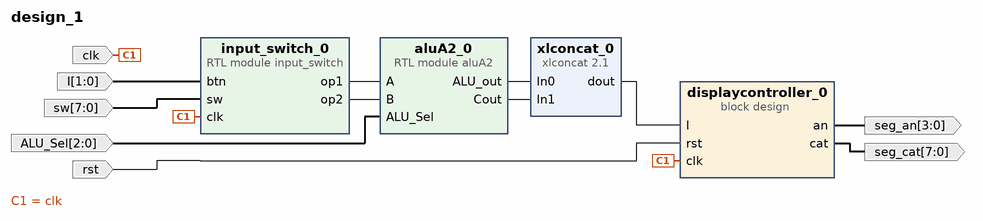
[diagram p0: block diagram of the top level]
# Vivado block design design_1, xc7z007sclg400-1, Vivado 2024.1.1
create_bd_design design_1

create_bd_port -dir I clk
create_bd_port -dir I -from 7 -to 0 sw
create_bd_port -dir I -from 1 -to 0 I
create_bd_port -dir I -from 2 -to 0 ALU_Sel
create_bd_port -dir I rst
create_bd_port -dir O -from 7 -to 0 seg_cat
create_bd_port -dir O -from 3 -to 0 seg_an

create_bd_cell -type container -reference displaycontroller displaycontroller_0
set_property -dict [list \
  CONFIG.ACTIVE_SIM_BD displaycontroller.bd \
  CONFIG.ACTIVE_SYNTH_BD displaycontroller.bd \
  CONFIG.ENABLE_DFX 0 \
  CONFIG.LIST_SIM_BD displaycontroller.bd \
  CONFIG.LIST_SYNTH_BD displaycontroller.bd \
  CONFIG.LOCK_PROPAGATE 0 \
] [get_bd_cells displaycontroller_0]
create_bd_cell -type module -reference aluA2 aluA2_0
create_bd_cell -type ip -vlnv xilinx.com:ip:xlconcat:2.1 xlconcat_0
set_property -dict {CONFIG.IN0_WIDTH 8 CONFIG.IN1_WIDTH 1} [get_bd_cells xlconcat_0]
create_bd_cell -type module -reference input_switch input_switch_0

# ---- connections ----

connect_bd_net [get_bd_ports ALU_Sel] [get_bd_pins aluA2_0/ALU_Sel]
connect_bd_net [get_bd_ports I] [get_bd_pins input_switch_0/btn]
connect_bd_net [get_bd_pins aluA2_0/ALU_out] [get_bd_pins xlconcat_0/In0]
connect_bd_net [get_bd_pins aluA2_0/Cout] [get_bd_pins xlconcat_0/In1]
connect_bd_net [get_bd_ports clk] [get_bd_pins input_switch_0/clk] [get_bd_pins displaycontroller_0/clk]
connect_bd_net [get_bd_pins displaycontroller_0/an] [get_bd_ports seg_an]
connect_bd_net [get_bd_pins displaycontroller_0/cat] [get_bd_ports seg_cat]
connect_bd_net [get_bd_pins input_switch_0/op1] [get_bd_pins aluA2_0/A]
connect_bd_net [get_bd_pins input_switch_0/op2] [get_bd_pins aluA2_0/B]
connect_bd_net [get_bd_ports rst] [get_bd_pins displaycontroller_0/rst]
connect_bd_net [get_bd_ports sw] [get_bd_pins input_switch_0/sw]
connect_bd_net [get_bd_pins xlconcat_0/dout] [get_bd_pins displaycontroller_0/I]

validate_bd_design
save_bd_design
